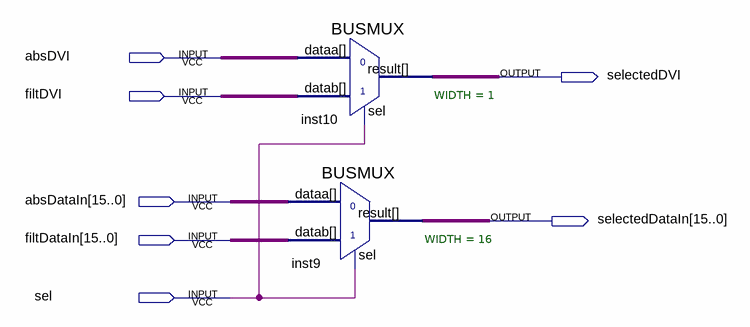
[diagram p0: schematic sheet]
// Quartus schematic filtBypassMux.bdf as structural Verilog: 2 symbols, 7 pins
module filtBypassMux (
  input  absDVI,
  input  filtDVI,
  input  [15:0] absDataIn,
  input  [15:0] filtDataIn,
  input  sel,
  output selectedDVI,
  output [15:0] selectedDataIn
);

  BUSMUX #(.WIDTH(1)) inst10 (.datab(filtDVI), .sel(sel), .dataa(absDVI), .result(selectedDVI));
  BUSMUX #(.WIDTH(16)) inst9 (.datab(filtDataIn), .sel(sel), .dataa(absDataIn), .result(selectedDataIn));
endmodule
